# EAGLE schematic ubadge (EAGLE 9.0.1)
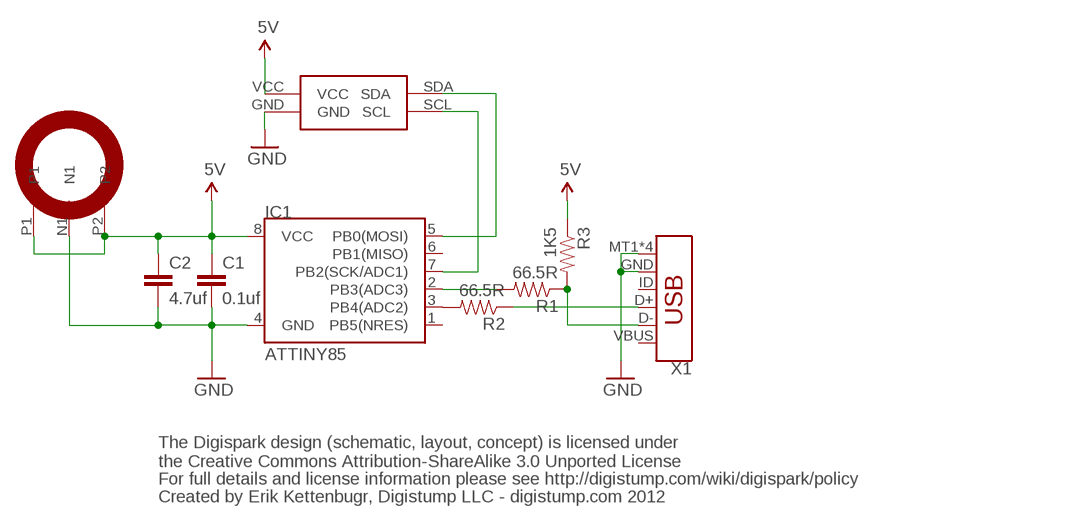
[diagram p0: schematic, sheet 1]

## Parts
C1  0.1uf  CAP0402-CAP  [0402-CAP]
C2  4.7uf  CAP0805  [0805]
IC1  ATTINY85  ATTINY45  [SO08-EIAJ]
R1  66.5R  RESISTOR0402-RES  [0402-RES]
R2  66.5R  RESISTOR0402-RES  [0402-RES]
R3  1K5  RESISTOR0402-RES  [0402-RES]
U$1  SAO-SMT-BOARD  [SAO-SMD-BADGE-SOCKET]
U$2  CR2032-VERT  [CR2032-VERT]
X1  USB_MICRO-B_SMT  [USB-MICROB]

## Nets
DM: R1.1 R3.2 X1.D-
DM-TINY: IC1.2(PB3(ADC3)) R1.2
DP: R2.1 X1.D+
DP-TINY: IC1.3(PB4(ADC2)) R2.2
GND: C1.2 C2.2 IC1.4(GND) U$1.GND U$2.N1 X1.GND X1.MT1(SHIELD) X1.MT2(SHIELD) X1.P$1(SHIELD) X1.P$2(SHIELD)
SCL: IC1.7(PB2(SCK/ADC1)) U$1.SCL
SDA: IC1.5(PB0(MOSI)) U$1.SDA
VCC: C1.1 C2.1 IC1.8(VCC) R3.1 U$1.VCC U$2.P1 U$2.P2 ; supply symbol labelled 5V
Unconnected: IC1.1(PB5(NRES)) IC1.6(PB1(MISO)) X1.ID

## Notes on the sheet
- The Digispark design (schematic, layout, concept) is licensed under
  the Creative Commons Attribution-ShareAlike 3.0 Unported License
- For full details and license information please see http://digistump.com/wiki/digispark/policy
- Created by Erik Kettenbugr, Digistump LLC - digistump.com 2012

## Power pins joined to a net without a drawn wire
VBUS: X1.VBUS

## Library data of the parts
C1 C2 = SparkFun:CAP: Capacitor Standard 0603 ceramic capacitor, and 0.1" leaded capacitor.
IC1 = SparkFun:ATTINY45: Atmel ATTiny45
R1-R3 = SparkFun:RESISTOR: Resistor Basic schematic elements and footprints for 0603, 1206, and PTH resistors.
U$1 = SAO:SAO-SMT-BOARD
U$2 = cr2032-vert:CR2032-VERT
X1 = SparkFun-Connectors:USB_MICRO-B: USB Type Micro-B Connector Male/female and PTH/SMT variants SparkFun Products: SparkFun microB USB Breakout <https://www.sparkfun.com/products/12035> SparkFun USB microB Plug Breakout <https://www.sparkfun.com/products/10031> SparkFun ESP8266 Thing <https://www.sparkfun.com/products/13231>; PROD_ID: CONN-09505; SF_ID: PRT-08533